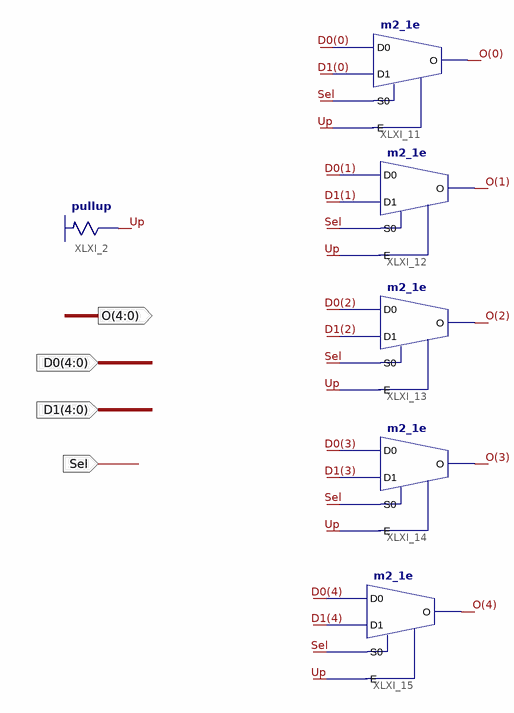
[diagram p0: schematic sheet 1]
// Xilinx ISE schematic AddressMux.sch (spartan3e) as structural Verilog: 6 symbols, 4 ports
module AddressMux (
  input  [4:0] D0,
  input  [4:0] D1,
  input  Sel,
  output [4:0] O
);

  wire Up;

  m2_1e XLXI_11 (.D0(D0[0]), .D1(D1[0]), .E(Up), .S0(Sel), .O(O[0]));
  m2_1e XLXI_12 (.D0(D0[1]), .D1(D1[1]), .E(Up), .S0(Sel), .O(O[1]));
  m2_1e XLXI_14 (.D0(D0[3]), .D1(D1[3]), .E(Up), .S0(Sel), .O(O[3]));
  m2_1e XLXI_13 (.D0(D0[2]), .D1(D1[2]), .E(Up), .S0(Sel), .O(O[2]));
  m2_1e XLXI_15 (.D0(D0[4]), .D1(D1[4]), .E(Up), .S0(Sel), .O(O[4]));
  \pullup  XLXI_2 (.O(Up));
endmodule
